# EAGLE design MIDI-Splitter (EAGLE 5.10)
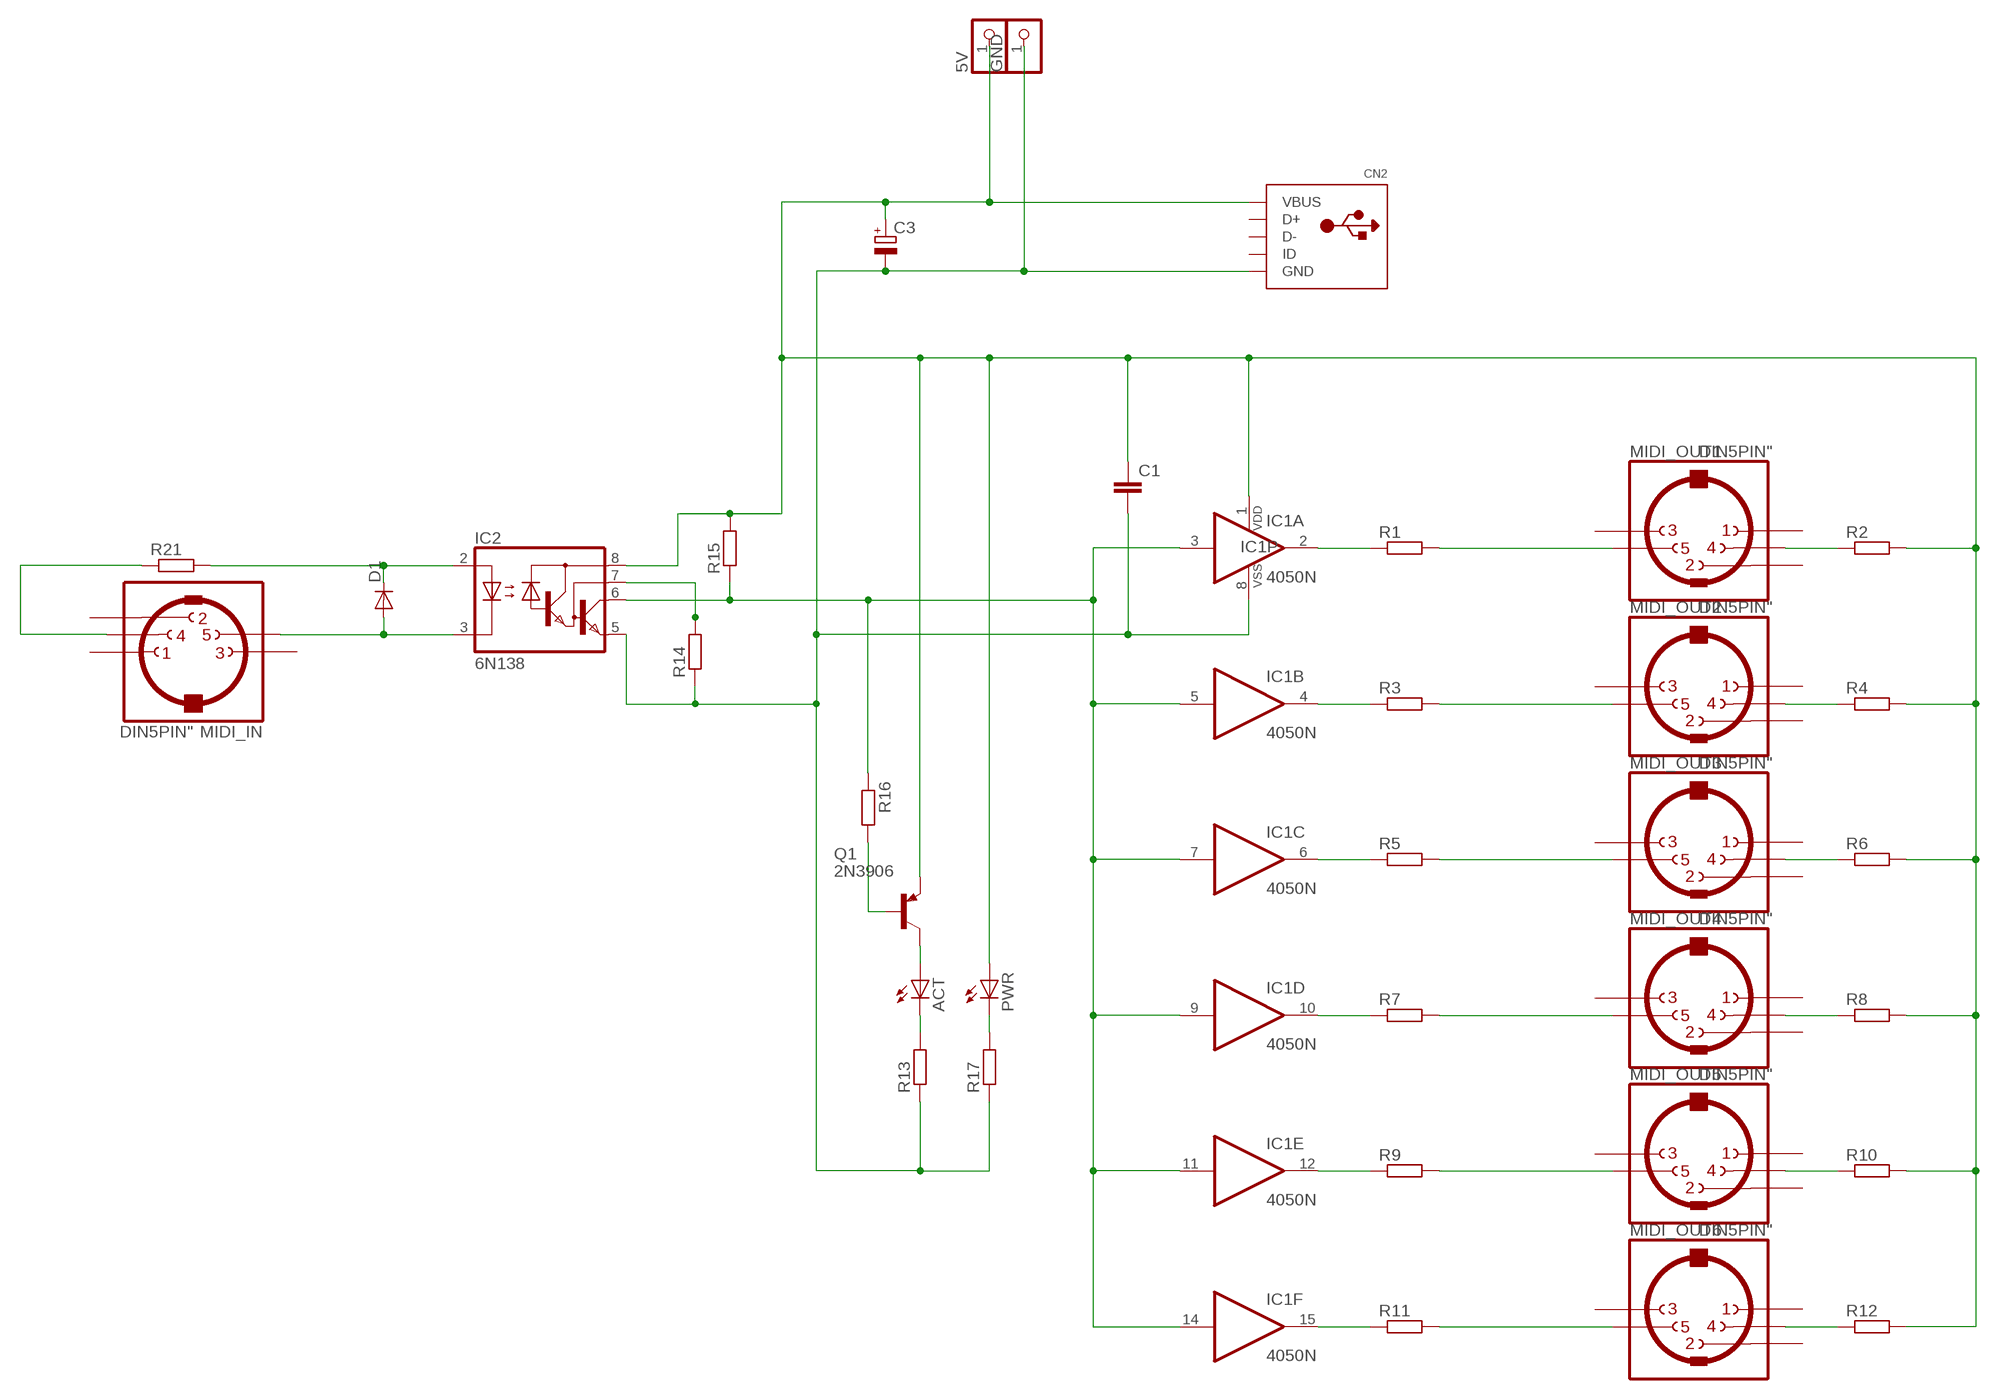
[diagram p0: schematic, sheet 1]

## Parts
5V  PINHD-1X1  [1X01]
ACT  LED3MM  [LED3MM]
C1  C-EU025-025X050  [C025-025X050]
C3  CPOL-EUE2.5-6  [E2,5-6]
CN2  USBTHM  [USB-MINIB-THM]
D1  1N4148DO35-7  [DO35-7]
GND  PINHD-1X1  [1X01]
IC1  4050N  [DIL16]
IC2  6N138  [DIL08]
MIDI_IN  DIN5PIN"  [TRUCONN90]
MIDI_OUT1  DIN5PIN"  [TRUCONN90]
MIDI_OUT2  DIN5PIN"  [TRUCONN90]
MIDI_OUT3  DIN5PIN"  [TRUCONN90]
MIDI_OUT4  DIN5PIN"  [TRUCONN90]
MIDI_OUT5  DIN5PIN"  [TRUCONN90]
MIDI_OUT6  DIN5PIN"  [TRUCONN90]
PWR  LED3MM  [LED3MM]
Q1  2N3906  [TO92]
R1  R-EU_0207/2V  [0207/2V]
R2  R-EU_0207/2V  [0207/2V]
R3  R-EU_0207/2V  [0207/2V]
R4  R-EU_0207/2V  [0207/2V]
R5  R-EU_0204/7  [0204/7]
R6  R-EU_0204/7  [0204/7]
R7  R-EU_0204/7  [0204/7]
R8  R-EU_0204/7  [0204/7]
R9  R-EU_0207/2V  [0207/2V]
R10  R-EU_0207/2V  [0207/2V]
R11  R-EU_0207/2V  [0207/2V]
R12  R-EU_0207/2V  [0207/2V]
R13  R-EU_0204/7  [0204/7]
R14  R-EU_0204/7  [0204/7]
R15  R-EU_0204/7  [0204/7]
R16  R-EU_0204/7  [0204/7]
R17  R-EU_0204/7  [0204/7]
R21  R-EU_0204/7  [0204/7]

## Nets
GND: C1.2 C3.- CN2.GND GND.1 IC1.8(P:VSS) IC2.5(GND) R13.1 R14.1 R17.1
N$1: IC1.2(A:O) R1.1
N$2: IC1.4(B:O) R3.1
N$3: IC1.6(C:O) R5.1
N$4: IC1.10(D:O) R7.1
N$5: IC1.12(E:O) R9.1
N$6: ACT.K(C) R13.2
N$7: MIDI_OUT1.5 R1.2
N$8: MIDI_OUT2.5 R3.2
N$9: MIDI_OUT3.5 R5.2
N$10: MIDI_OUT4.5 R7.2
N$11: MIDI_OUT5.5 R9.2
N$12: MIDI_OUT6.5 R11.2
N$13: MIDI_OUT1.4 R2.1
N$14: MIDI_OUT2.4 R4.1
N$15: MIDI_OUT3.4 R6.1
N$16: MIDI_OUT4.4 R8.1
N$17: MIDI_OUT5.4 R10.1
N$18: MIDI_OUT6.4 R12.1
N$19: IC1.15(F:O) R11.1
N$20: ACT.A Q1.1(C)
N$22: Q1.2(B) R16.2
N$23: PWR.K(C) R17.2
N$41: D1.A IC2.3(C) MIDI_IN.5
N$42: MIDI_IN.4 R21.1
N$43: D1.C IC2.2(A) R21.2
N$46: IC2.7(VB) R14.2
SIG: IC1.3(A:I) IC1.5(B:I) IC1.7(C:I) IC1.9(D:I) IC1.11(E:I) IC1.14(F:I) IC2.6(VO) R15.1 R16.1
VDD: 5V.1 C1.1 C3.+ CN2.VBUS IC1.1(P:VDD) IC2.8(VCC) PWR.A Q1.3(E) R2.2 R4.2 R6.2 R8.2 R10.2 R12.2 R15.2
Unconnected: CN2.D+ CN2.D- CN2.ID MIDI_IN.1 MIDI_IN.2 MIDI_IN.3 MIDI_OUT1.1 MIDI_OUT1.2 MIDI_OUT1.3 MIDI_OUT2.1 MIDI_OUT2.2 MIDI_OUT2.3 MIDI_OUT3.1 MIDI_OUT3.2 MIDI_OUT3.3 MIDI_OUT4.1 MIDI_OUT4.2 MIDI_OUT4.3 MIDI_OUT5.1 MIDI_OUT5.2 MIDI_OUT5.3 MIDI_OUT6.1 MIDI_OUT6.2 MIDI_OUT6.3

## Library data of the parts
5V GND = pinhead:PINHD-1X1: PIN HEADER
ACT PWR = led:LED: LED OSRAM: - CHIPLED LG R971, LG N971, LY N971, LG Q971, LY Q971, LO R971, LY R971 LH N974, LH R974 LS Q976, LO Q976, LY Q976 LO Q996 - Hyper CHIPLED LW Q18S LB Q993, LB Q99A, LB R99A - SideLED LS A670, LO A670, LY A670, LG A670, LP A670 LB A673, LV A673, LT A673, LW A673 LH A674 LY A675 LS A676, LA A676, LO A676, LY A676, LW A676 LS A679, LY A679, LG A679 - Hyper Micro SIDELED® LS Y876, LA Y876, LO Y876, LY Y876 LT Y87S - SmartLED LW L88C, LW L88S LB L89C, LB L89S, LG L890 LS L89K, LO L89K, LY L89K LS L896, LA L896, LO L896, LY L896 - TOPLED LS T670, LO T670, LY T670, LG T670, LP T670 LSG T670, LSP T670, LSY T670, LOP T670, LYG T670 LG T671, LOG T671, LSG T671 LB T673, LV T673, LT T673, LW T673 LH T674 LS T676, LA T676, LO T676, LY T676, LB T676, LH T676, LSB T676, LW T676 LB T67C, LV T67C, LT T67C, LS T67K, LO T67K, LY T67K, LW E67C LS E67B, LA E67B, LO E67B, LY E67B, LB E67C, LV E67C, LT E67C LW T67C LS T679, LY T679, LG T679 LS T770, LO T770, LY T770, LG T770, LP T770 LB T773, LV T773, LT T773, LW T773 LH T774 LS E675, LA E675, LY E675, LS T675 LS T776, LA T776, LO T776, LY T776, LB T776 LHGB T686 LT T68C, LB T68C - Hyper Mini TOPLED® LB M676 - Mini TOPLED Santana® LG M470 LS M47K, LO M47K, LY M47K Source: http://www.osram.convergy.de LUXEON: - LUMILED® LXK2-PW12-R00, LXK2-PW12-S00, LXK2-PW14-U00, LXK2-PW14-V00 LXK2-PM12-R00, LXK2-PM12-S00, LXK2-PM14-U00 LXK2-PE12-Q00, LXK2-PE12-R00, LXK2-PE12-S00, LXK2-PE14-T00, LXK2-PE14-U00 LXK2-PB12-K00, LXK2-PB12-L00, LXK2-PB12-M00, LXK2-PB14-N00, LXK2-PB14-P00, LXK2-PB14-Q00 LXK2-PR12-L00, LXK2-PR12-M00, LXK2-PR14-Q00, LXK2-PR14-R00 LXK2-PD12-Q00, LXK2-PD12-R00, LXK2-PD12-S00 LXK2-PH12-R00, LXK2-PH12-S00 LXK2-PL12-P00, LXK2-PL12-Q00, LXK2-PL12-R00 Source: www.luxeon.com KINGBRIGHT: KA-3528ASYC Source: www.kingbright.com
C1 = rcl:C-EU: CAPACITOR, European symbol
C3 = rcl:CPOL-EU: POLARIZED CAPACITOR, European symbol
CN2 = adafruit:USB: USB Connectors USBMINIB - Surface Mount Female Mini-B USB Connector 4UConnector: 06564 By microbuilder.eu Thru-hole RA Female Mini-B USB Connector 4UConnector: 18732 By ladyada.net
D1 = diode:1N4148: DIODE high speed (Philips)
IC1 = 40xx:4050: Hex non-inverting BUFFER
IC2 = optocoupler:6N138: MOTOROLA OPTO COUPLER
MIDI_IN MIDI_OUT1-MIDI_OUT6 = jasons_stuff:DIN5PIN: Female CONNECTOR 5 pins 90 deg. with shield, horizontal (DIN 41524)
Q1 = transistor-pnp:2N3906: PNP Transistor
R1-R12 = rcl:R-EU_: RESISTOR, European symbol
R13-R17 R21 = resistor:R-EU_: RESISTOR, European symbol

## Board
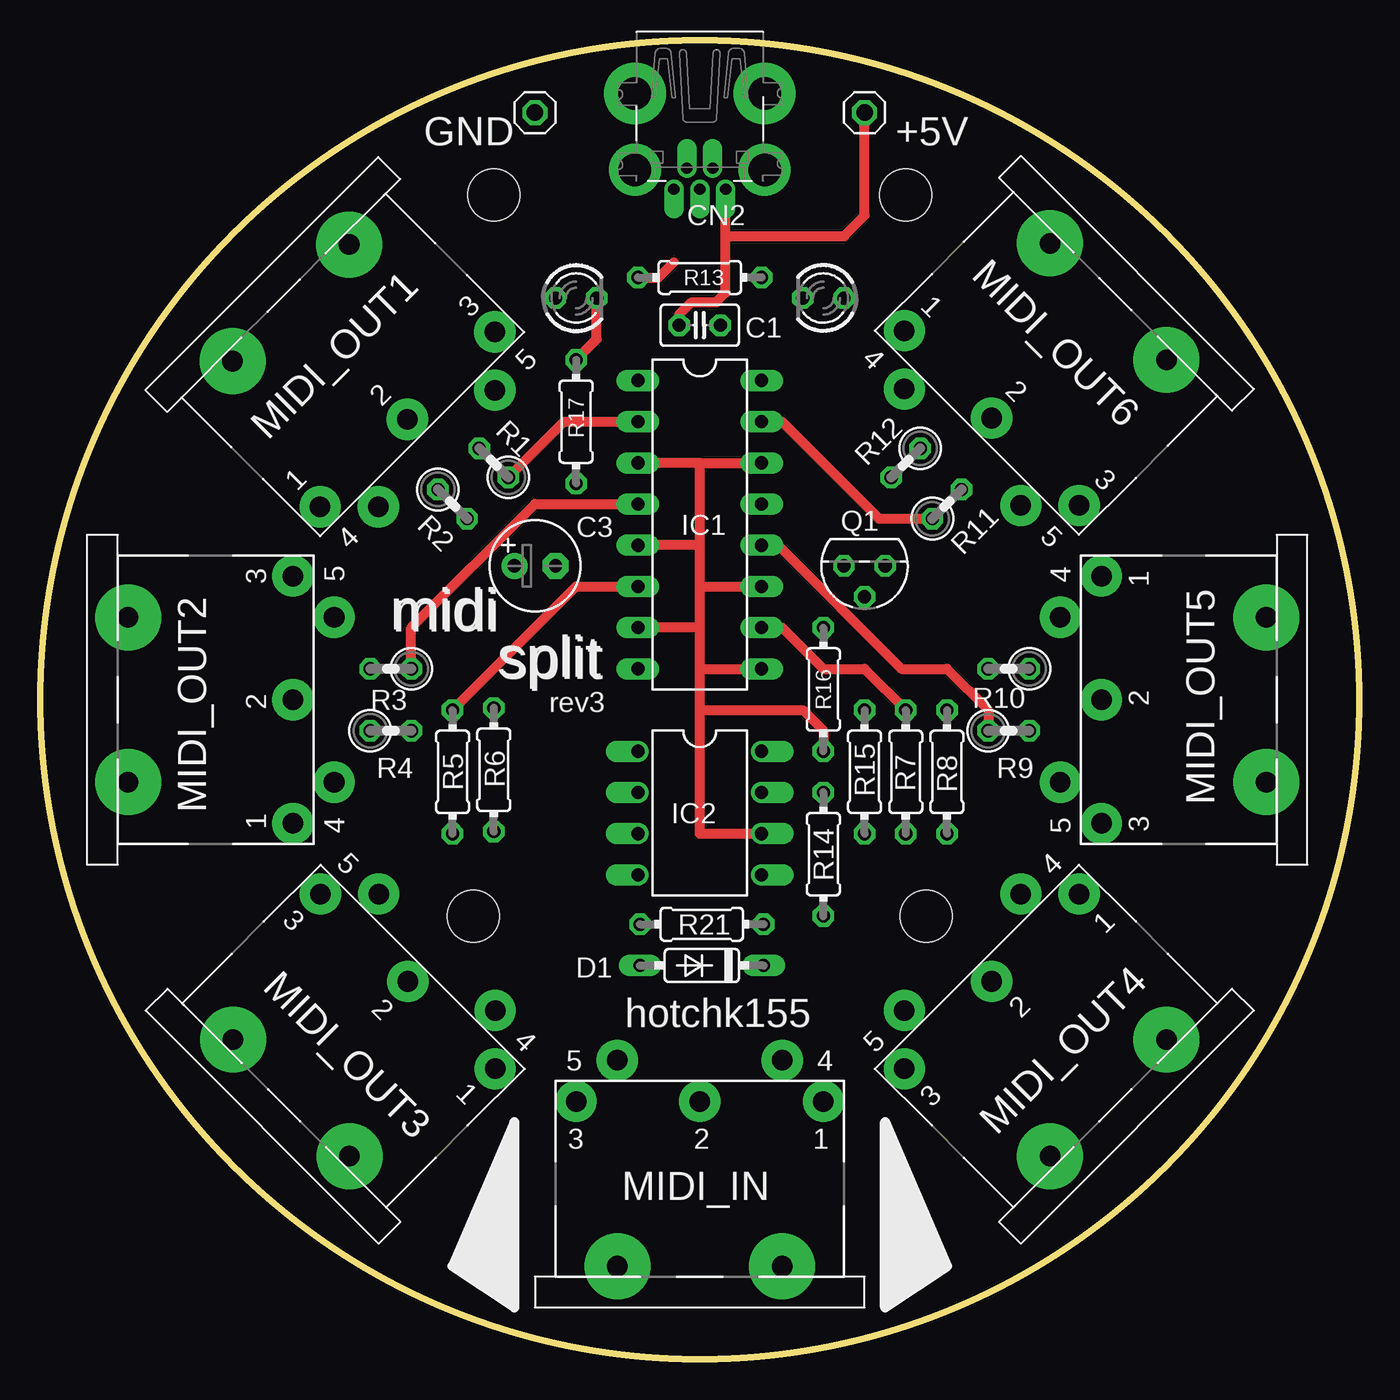
[diagram p1: board, top side]
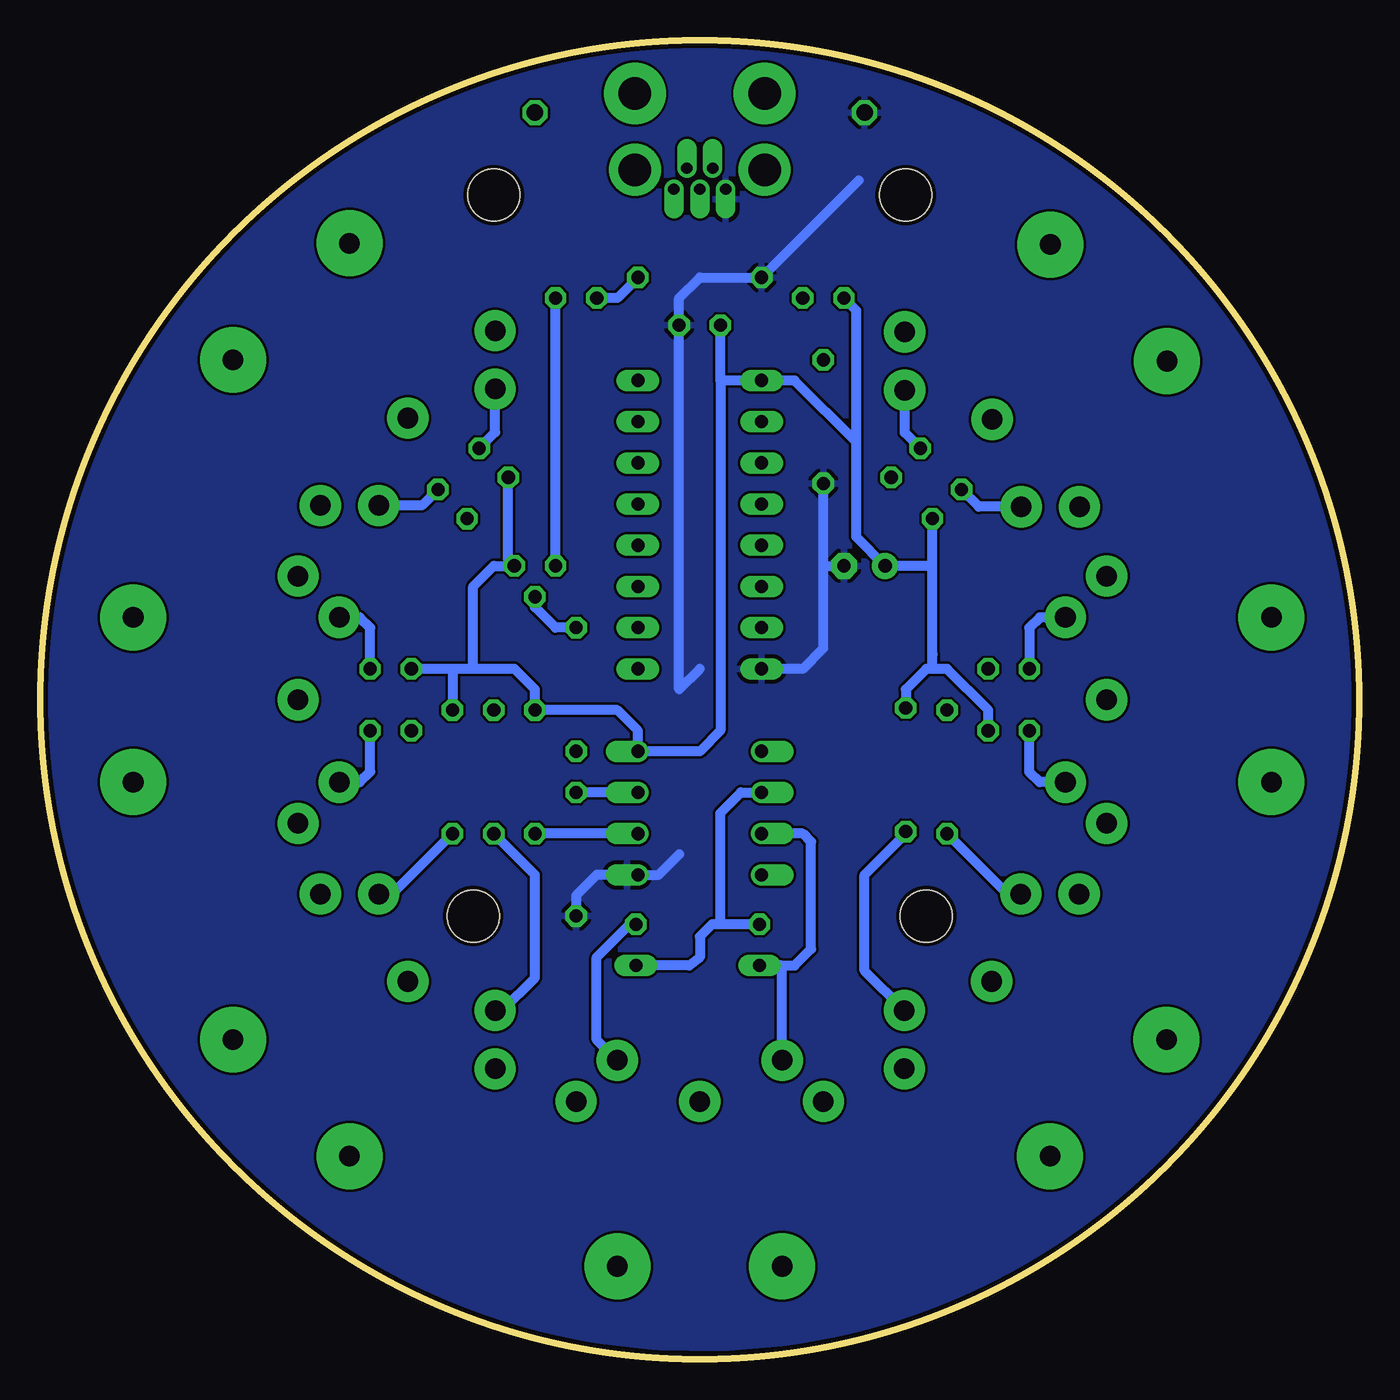
[diagram p2: board, bottom side, seen from below]

Size 81.28 x 81.28 mm. Coordinates in mm from the lower left corner, seen from the top.
Outline: circle at 40.64,40.64 radius 40.64
Copper layers (1*16): Top 0.035mm / dielectric 1.5mm / Bottom 0.035mm
Design rules "ITEADstudio_DRC": minimum track width 6mil, minimum drill 12mil, track to track 6mil, track to pad 6mil, pad to pad 6mil, via to via 6mil, smd to smd 0mil, copper to edge 10mil, drill to drill 10mil, minimum pad ring 10mil, minimum via ring 6mil, stop-mask expansion 2mil, vias tented up to drill 100mil, thermal gap 10mil
Holes 3.2 mm at 27.94,71.75 26.67,27.3 53.34,71.75 54.61,27.3

### Footprints (pad centres in the part's own frame; a part is rotated, then mirrored left to right if it is on the bottom)
1X01 = drill 1.016 octagon: 1 0,0
LED3MM = drill 0.813 octagon: A -1.27,0; K 1.27,0
C025-025X050 = drill 0.813 octagon: 1 -1.27,0; 2 1.27,0
E2,5-6 = drill 0.813 pad 1.6 round: + -1.27,0 | drill 0.813 pad 1.6 octagon: - 1.27,0
USB-MINIB-THM = drill 0.7 offset: D+ 0,9.8; D- -0.8,8.5; GND 1.6,9.8; ID 0.8,8.5; VBUS -1.6,9.8 | drill 2 pad 3.81 round: GND1 -4,3.9; GND4 4,3.9 | drill 2 pad 3.2 round: GND2 -4,8.6; GND3 4,8.6
DO35-7 = drill 0.813 long: A 3.81,0; C -3.81,0
DIL16 = drill 0.813 long: 1 -8.89,-3.81; 2 -6.35,-3.81; 3 -3.81,-3.81; 4 -1.27,-3.81; 5 1.27,-3.81; 6 3.81,-3.81; 7 6.35,-3.81; 8 8.89,-3.81; 9 8.89,3.81; 10 6.35,3.81; 11 3.81,3.81; 12 1.27,3.81; 13 -1.27,3.81; 14 -3.81,3.81; 15 -6.35,3.81; 16 -8.89,3.81
DIL08 = drill 0.813 offset: 1 -3.81,-3.81; 2 -1.27,-3.81; 3 1.27,-3.81; 4 3.81,-3.81; 5 3.81,3.81; 6 1.27,3.81; 7 -1.27,3.81; 8 -3.81,3.81
TRUCONN90 = drill 1.27 pad 2.54 round: 1 7.62,5.08; 2 0,5.08; 3 -7.62,5.08; 4 5.08,7.62; 5 -5.08,7.62 | drill 1.27 pad 4.064 round: NC -5.08,-5.08; NC@ 5.08,-5.08
TO92 = drill 0.813 octagon: 1 1.27,0; 2 0,1.905; 3 -1.27,0
0207/2V = drill 0.813 octagon: 1 -1.27,0; 2 1.27,0
0204/7 = drill 0.813 octagon: 1 -3.81,0; 2 3.81,0

### Placement (x,y rotation side)
5V  50.8,76.84 0 top
ACT  48.26,65.41 180 top
C1  40.64,63.73 0 top
C3  30.48,48.89 0 top
CN2  40.64,81.91 180 top
D1  40.77,24.26 180 top
GND  30.48,76.84 0 top
IC1  40.64,51.43 270 top
IC2  40.64,33.66 270 top
MIDI_IN  40.64,10.79 0 top
MIDI_OUT1  19.02,61.52 225 top
MIDI_OUT2  10.48,40.64 270 top
MIDI_OUT3  19.05,19.68 315 top
MIDI_OUT4  62.23,19.68 45 top
MIDI_OUT5  70.48,40.64 90 top
MIDI_OUT6  62.23,61.59 135 top
PWR  33.02,65.41 0 top
Q1  50.8,48.89 180 top
R1  27.94,55.24 135 top
R2  25.4,52.7 315 top
R3  21.59,42.54 180 top
R4  21.59,38.73 0 top
R5  25.4,36.2 270 top
R6  27.94,36.32 90 top
R7  53.34,36.2 270 top
R8  55.88,36.2 90 top
R9  59.69,38.73 0 top
R10  59.69,42.54 180 top
R11  55.88,52.7 45 top
R12  53.34,55.24 225 top
R13  40.64,66.68 0 top
R14  48.26,31.11 90 top
R15  50.8,36.2 90 top
R16  48.26,41.27 90 top
R17  33.02,57.78 90 top
R21  40.77,26.8 180 top

### Tracks (layer width: path | path; a pad name or v marks a point on that pad's centre or on a via)
GND
  Top 0.61: 39.04,67.62 38.1,66.68 R13.1
  Bottom 0.61: 41.91,31.11 43.18,29.84 IC2.5 46.99,29.84 48.26,28.57 R14.1 | 40.64,42.54 41.91,41.27 C1.2 41.91,65.41 40.64,66.68 R13.1 30.85,72.65 | 33.02,48.89 33.02,43.81 34.29,42.54 IC1.8 | 33.02,48.89 R17.1 | 33.02,48.89 C3.-
  pour Bottom: 0,40 0,41.27 arc-90 40.64,81.91 arc-90 81.28,41.27 arc-178
N$1
  Top 0.61: IC1.2 32.28,57.78 R1.1
N$2
  Top 0.61: IC1.4 30.48,52.7 22.86,45.09 R3.1
N$3
  Top 0.61: IC1.6 33.02,47.62 R5.1
N$4
  Top 0.61: IC1.10 45.72,45.09 48.26,42.54 50.8,42.54 R7.1
N$5
  Top 0.61: IC1.12 45.47,50.16 53.09,42.54 55.88,42.54 58.42,40 R9.1
N$6
  Bottom 0.61: ACT.K 45.72,65.41 R13.2
N$7
  Bottom 0.61: MIDI_OUT1.5 28.01,57.11 R1.2
N$8
  Bottom 0.61: MIDI_OUT2.5 19.69,45.72 20.32,45.09 R3.2
N$9
  Bottom 0.61: R5.2 21.68,28.66 MIDI_OUT3.5
N$10
  Bottom 0.61: R7.2 50.8,29.84 50.8,23.49 52.81,21.48 MIDI_OUT4.5
N$11
  Bottom 0.61: MIDI_OUT5.5 61.59,35.56 60.96,36.2 R9.2
N$12
  Bottom 0.61: MIDI_OUT6.5 57.77,52.61 R11.2
N$13
  Bottom 0.61: MIDI_OUT1.4 23.44,52.54 R2.1
N$14
  Bottom 0.61: MIDI_OUT2.4 19.69,35.56 20.32,36.2 R4.1
N$15
  Bottom 0.61: MIDI_OUT3.4 30.48,23.93 30.48,29.84 27.94,32.38 R6.1
N$16
  Bottom 0.61: R8.1 59.6,28.66 MIDI_OUT4.4
N$17
  Bottom 0.61: MIDI_OUT5.4 61.59,45.72 60.96,45.09 R10.1
N$18
  Bottom 0.61: MIDI_OUT6.4 53.25,57.13 R12.1
N$19
  Top 0.61: IC1.15 45.72,57.78 51.7,51.81 R11.1
N$20
  Bottom 0.61: Q1.1 ACT.A
N$22
  Bottom 0.61: Q1.2 50.8,46.35 49.53,45.09 R16.2
N$23
  Top 0.61: PWR.K 34.29,62.86 R17.2
N$41
  Bottom 0.61: MIDI_IN.5 35.56,24.26 | 35.56,24.26 D1.A | IC2.3 34.29,32.38 33.78,31.88 33.78,25.27 34.8,24.26 35.56,24.26
N$42
  Bottom 0.61: R21.1 44.96,26.8 46.99,24.76 46.99,19.68 MIDI_IN.4
N$43
  Bottom 0.61: R21.2 39.37,26.8 | 39.37,26.8 39.88,26.8 40.64,26.03 40.64,24.76 41.28,24.26 D1.C | IC2.2 38.1,34.92 39.37,33.66 39.37,26.8
N$46
  Bottom 0.61: IC2.7 R14.2
SIG
  Top 0.61: 40.64,55.24 IC1.3 | 40.64,55.24 IC1.14 | 40.64,45.09 40.64,47.62 | 40.64,47.62 40.64,50.16 | 40.64,50.16 40.64,55.24 | 40.64,45.09 IC1.7 | 40.64,50.16 IC1.5 | 40.64,47.62 IC1.11 | 40.64,42.54 IC1.9 | 40.64,42.54 40.64,45.09 | IC2.6 40.64,32.38 40.64,40 | 40.64,40 40.64,42.54 | R16.1 48.26,38.73 46.99,40 40.64,40
  Bottom 0.61: IC2.6 R15.1
VDD
  Top 0.61: R12.2 52.44,54.36 | 42.24,69.22 42.24,65.73 41.66,65.15 40.13,65.15 39.37,64.39 C1.1 | 5V.1 50.8,70.48 49.53,69.22 42.24,69.22 | 42.24,69.22 CN2.VBUS
  Bottom 0.61: 54.61,42.54 55.88,42.54 | 55.88,42.54 R10.2 | 54.61,42.54 54.61,47.62 53.34,48.89 Q1.3 52.44,49.27 R12.2 | 26.3,48.89 26.3,43.44 26.29,43.43 26.29,42.54 | 26.3,48.89 R2.2 | 30.99,56.52 34.8,60.32 IC1.1 39.37,60.32 | 26.3,48.89 C3.+ 30.99,50.67 30.99,56.52 | 39.37,60.32 39.37,38.73 40.64,37.46 IC2.8 44.45,38.73 45.72,40 R15.2 50.8,41.27 52.07,42.54 54.61,42.54 | 39.37,60.32 C1.1 | 30.99,56.52 30.99,64.64 PWR.A | R4.2 22.86,40 25.4,42.54 26.29,42.54 | 26.29,42.54 26.67,42.54 27.94,41.27 R6.2 | 55.88,42.54 R8.2

### Text on the board
tPlace: GND | +5V | midi | midi | split | split | rev3 | hotchk155